# Altium schematic sheet Power.SchDoc
size A; SheetNumber: 7; SheetTotal: 8
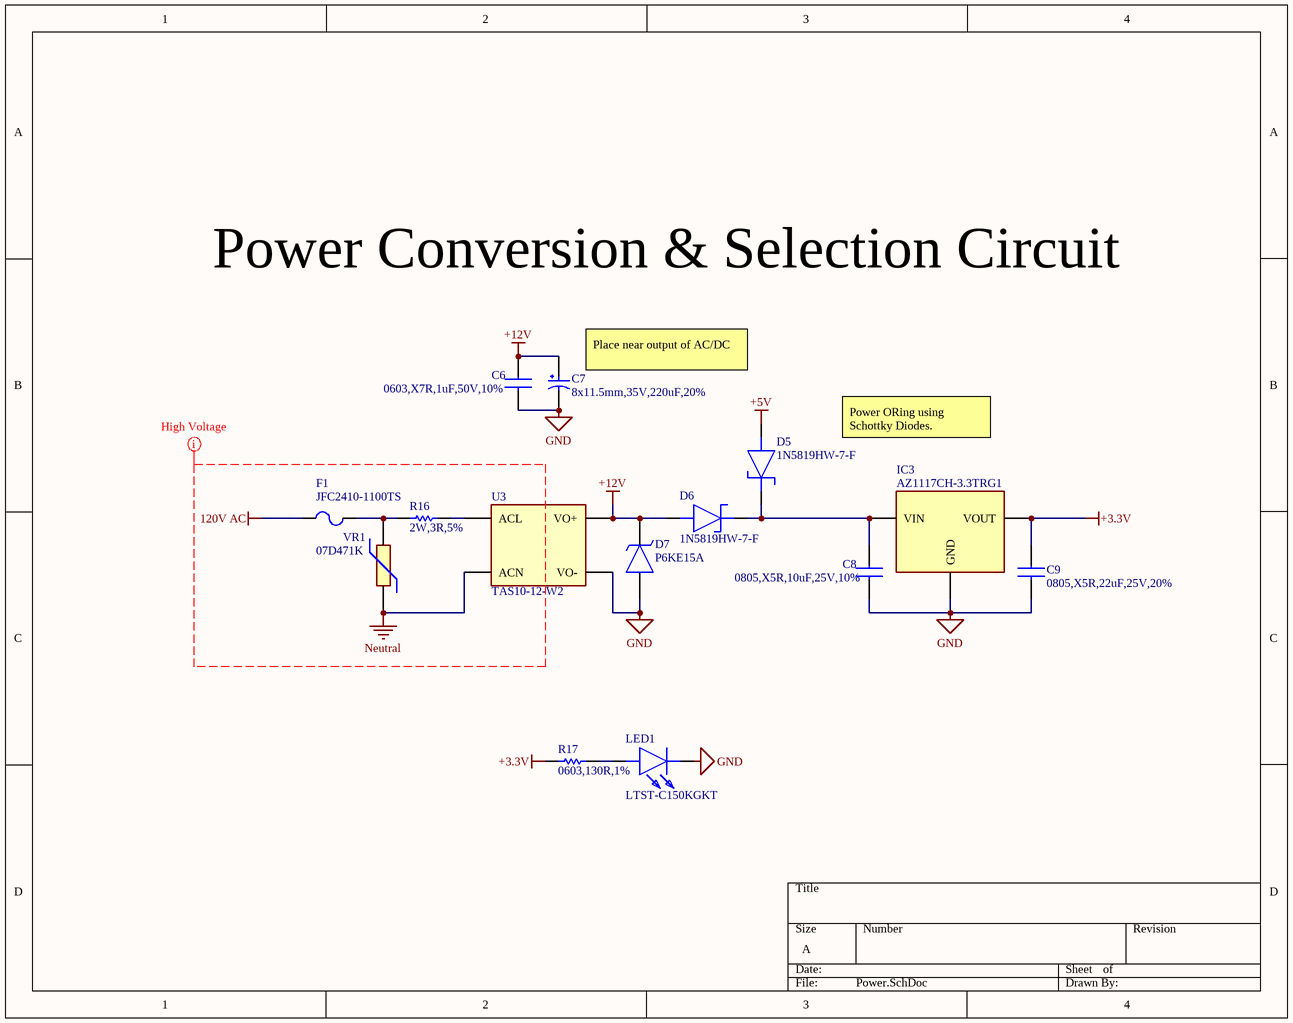
[diagram p0: Power.SchDoc]

## Parts
C6  0603,X7R,1uF,50V,10%  [CAPC1608X90N]
C7  8x11.5mm,35V,220uF,20%  [CAPPRD350W60D825H1350]
C8  0805,X5R,10uF,25V,10%  [CAPC2012X145N]
C9  0805,X5R,22uF,25V,20%  [CAPC2012X145N]
D5  1N5819HW-7-F  [SOD3716X145N]
D6  1N5819HW-7-F  [SOD3716X145N]
D7  P6KE15A  [DIOAD1936W88L640D324]
F1  JFC2410-1100TS  [F2410]
IC3  AZ1117CH-3.3TRG1  [SOT230P700X180-4N]
LED1  LTST-C150KGKT  [LEDC3216X120N]
R16  2W,3R,5%  [RES-TH_BD4.0-L11.5-P15.50-D0.7]
R17  0603,130R,1%  [RESC1608X55N]
U3  TAS10-12-W2  [PWRM-TH_TAS10-XX-W2]
VR1  07D471K  [RES-TH_L9.0-W6.2-P5.00-D0.7-S6.20]

## Nets
120V AC: F1.1
+3.3V: C9.2 IC3.2(OUTPUT) IC3.4(VOUT) R17.2
+5V: D5.2(A)
+12V: C6.2 C7.1(+) D6.2(A) D7.1(K) U3.6(VO+)
GND: C6.1 C7.2(-) C8.1 C9.1 D7.2(A) IC3.1(GND) LED1.1(K) U3.4(VO-)
Neutral: U3.1(ACN) VR1.1
NetC8_2: C8.2 D5.1(K) D6.1(K) IC3.3(VIN)
NetF1_2: F1.2 R16.1 VR1.2
NetLED1_2: LED1.2(A) R17.1
NetR16_2: R16.2 U3.2(ACL)

## Layout directives
net class High-Voltage: 120V AC, Neutral

## Notes on the sheet
- Power Conversion & Selection Circuit
- (near C7) Place near output of AC/DC
- Power ORing using Schottky Diodes.

## Library data of the parts
C6 = CC0603KRX7R9BB105: 50V 1uF X7R ±10% 0603 Multilayer Ceramic Capacitors MLCC - SMD/SMT ROHS; Manufacturer_Name: YAGEO; Datasheet Link: https://www.yageo.com/upload/media/product/app/datasheet/mlcc/upy-gphc_x7r_6_3v-to-250v.pdf; Height: 0.95mm; Manufacturer_Part_Number: CC0603KRX7R9BB105; Mouser Part Number: 603-CC603KRX7R9BB105; Mouser Price/Stock: https://www.mouser.co.uk/ProductDetail/YAGEO/CC0603KRX7R9BB105?qs=6wERJjOp3mmF17%252BYi8cgJQ%3D%3D; Arrow Part Number: CC0603KRX7R9BB105; Arrow Price/Stock: https://www.arrow.com/en/products/cc0603krx7r9bb105/yageo?utm_currency=USD&region=nac; LCSC Part Number: C559769
C7 = 35ZLH220MEFC8X11.5: 220uF 35V 472.5mA@120Hz ±20% Through Hole,D8xL11.5mm Aluminum Electrolytic Capacitors - Leaded ROHS; Manufacturer_Name: Rubycon; Datasheet Link: http://www.rubycon.co.jp/EN/CATALOG/E_PDFS/ALUMINUM/E_ZLH.PDF; Height: 13.5mm; Manufacturer_Part_Number: 35ZLH220MEFC8X11.5; Mouser Part Number: 232-35ZLH220MEFC8X15; Mouser Price/Stock: https://www.mouser.co.uk/ProductDetail/Rubycon/35ZLH220MEFC8X11.5?qs=T3oQrply3y%252BhdplO5%252Bmtcg%3D%3D; Arrow Part Number: 35ZLH220MEFC8X11.5; Arrow Price/Stock: https://www.arrow.com/en/products/35zlh220mefc8x11.5/rubycon?utm_currency=USD&region=nac; LCSC Part Number: C107639
C8 = CC0805KKX5R8BB106: 10 µF ±10% 25V Ceramic Capacitor X5R 0805 (2012 Metric); Manufacturer_Name: YAGEO; Datasheet Link: https://www.yageo.com/upload/media/product/productsearch/datasheet/mlcc/UPY-GPHC_X5R_4V-to-50V_27.pdf; Height: 1.45mm; Manufacturer_Part_Number: CC0805KKX5R8BB106; Mouser Part Number: 603-CC805KKX5R8BB106; Mouser Price/Stock: https://www.mouser.co.uk/ProductDetail/YAGEO/CC0805KKX5R8BB106?qs=57cj7OiSijm89pM64t1AGQ%3D%3D; Arrow Part Number: CC0805KKX5R8BB106; Arrow Price/Stock: https://www.arrow.com/en/products/cc0805kkx5r8bb106/yageo?utm_currency=USD&region=nac; LCSC Part Number: C89831
C9 = CC0805MKX5R8BB226: 22 µF ±20% 25V Ceramic Capacitor X5R 0805 (2012 Metric); Manufacturer_Name: YAGEO; Datasheet Link: https://www.yageo.com/upload/media/product/productsearch/datasheet/mlcc/UPY-GPHC_X5R_4V-to-50V_26.pdf; Height: 1.45mm; Manufacturer_Part_Number: CC0805MKX5R8BB226; Mouser Part Number: 603-CC805MKX5R8BB226; Mouser Price/Stock: https://www.mouser.co.uk/ProductDetail/YAGEO/CC0805MKX5R8BB226?qs=WS5Jv%252B%252Bx1qULWDK6O%2FQuig%3D%3D; LCSC Part Number: C784585
D5 D6 = 1N5819HW-7-F: 40V 450mV@1A 1A SOD-123 Schottky Diodes ROHS; Manufacturer_Name: Diodes Incorporated; Datasheet Link: https://www.diodes.com//assets/Datasheets/1N5819HW.pdf; Height: 1.45mm; Manufacturer_Part_Number: 1N5819HW-7-F; Mouser Part Number: 621-1N5819HW-F; Mouser Price/Stock: https://www.mouser.co.uk/ProductDetail/Diodes-Incorporated/1N5819HW-7-F?qs=NQ47qNm99eDyWTEd07miYA%3D%3D; Arrow Part Number: 1N5819HW-7-F; Arrow Price/Stock: https://www.arrow.com/en/products/1n5819hw-7-f/diodes-incorporated?utm_currency=USD&region=nac; LCSC Part Number: C82544
D7 = P6KE15A: 147A@8/20us 600W@10/1000us 27.2V 15.8V Unidirectional 13V DO-15 ESD and Surge Protection (TVS/ESD) ROHS; Manufacturer_Name: STMicroelectronics; Datasheet Link: http://www.st.com/web/en/resource/technical/document/datasheet/CD00000720.pdf; Manufacturer_Part_Number: P6KE15A; Mouser Part Number: 511-P6KE15A; Mouser Price/Stock: https://www.mouser.co.uk/ProductDetail/STMicroelectronics/P6KE15A?qs=TGPpmpbSrT5hhHGF%252BJ4hqw%3D%3D; Arrow Part Number: P6KE15A; Arrow Price/Stock: https://www.arrow.com/en/products/p6ke15a/stmicroelectronics?region=nac; LCSC Part Number: C1974865
F1 = JFC2410-1100TS: 50A Surface Mount Fuse 1A 250V 250V 2410 Disposable fuses ROHS; LCSC Part Number: C136380
IC3 = AZ1117CH-3.3TRG1: 70dB@(120Hz) 1.35A Fixed 3.3V Positive 10V SOT-223 Voltage Regulators - Linear, Low Drop Out (LDO) Regulators ROHS; Manufacturer_Name: Diodes Incorporated; Datasheet Link: https://www.diodes.com//assets/Datasheets/AZ1117C.pdf; Height: 1.8mm; Manufacturer_Part_Number: AZ1117CH-3.3TRG1; Mouser Part Number: 621-AZ1117CH-3.3TRG1; Mouser Price/Stock: https://www.mouser.co.uk/ProductDetail/Diodes-Incorporated/AZ1117CH-3.3TRG1?qs=FKu9oBikfSm7ntaG6olPSQ%3D%3D; Arrow Part Number: AZ1117CH-3.3TRG1; Arrow Price/Stock: https://www.arrow.com/en/products/az1117ch-3.3trg1/diodes-incorporated?utm_currency=USD&region=nac; LCSC Part Number: C92102
LED1 = LTST-C150KGKT: 20mA 44.5mcd Water Clear -55℃~+85℃ 571nm Yellow Green 130° 75mW 2V 1206 LED Indication - Discrete ROHS; Manufacturer_Name: Lite-On; Datasheet Link: http://optoelectronics.liteon.com/upload/download/ds22-2000-072/ltst-c150kgkt.pdf; Height: 1.2mm; Manufacturer_Part_Number: LTST-C150KGKT; Mouser Part Number: 859-LTST-C150KGKT; Mouser Price/Stock: https://www.mouser.co.uk/ProductDetail/Lite-On/LTST-C150KGKT?qs=G7lFeYdtIHB%2FzaFKBwEyXw%3D%3D; Arrow Part Number: LTST-C150KGKT; Arrow Price/Stock: https://www.arrow.com/en/products/ltst-c150kgkt/lite-on-technology?utm_currency=USD&region=nac; LCSC Part Number: C125085
R16 = MFR2WSJT-73-3R: Metal Film Resistor 3Ω 2W ±5% Through Hole,D4.5xL11.5mm Through Hole Resistors ROHS; LCSC Part Number: C176580
R17 = RC0603FR-07130RL: 130 Ohms ±1% 0.1W, 1/10W Chip Resistor 0603 (1608 Metric) Moisture Resistant Thick Film; Manufacturer_Name: YAGEO; Datasheet Link: https://www.mouser.com/catalog/specsheets/YAGEO_PYu_RC_Group_51_RoHS_L_12.pdf; Height: 0.55mm; Manufacturer_Part_Number: RC0603FR-07130RL; LCSC Part Number: C141677
U3 = TAS10-12-W2: 12V 830mA 85VAC~265VAC 100V~370V 10W AC/DC-DC 85% Through Hole,25x39mm AC-DC Power Modules ROHS; LCSC Part Number: C2687656
VR1 = 07D471K: 775V 385V 300V 423V~517V Through Hole,P=5mm Varistors ROHS; LCSC Part Number: C28756